# Altium schematic sheet 04_PSoC6.SchDoc: PSoC6
size A; Revision: A; SheetNumber: 4; SheetTotal: 8; ECE315_Project_Name: ECE453 MCU Base Project
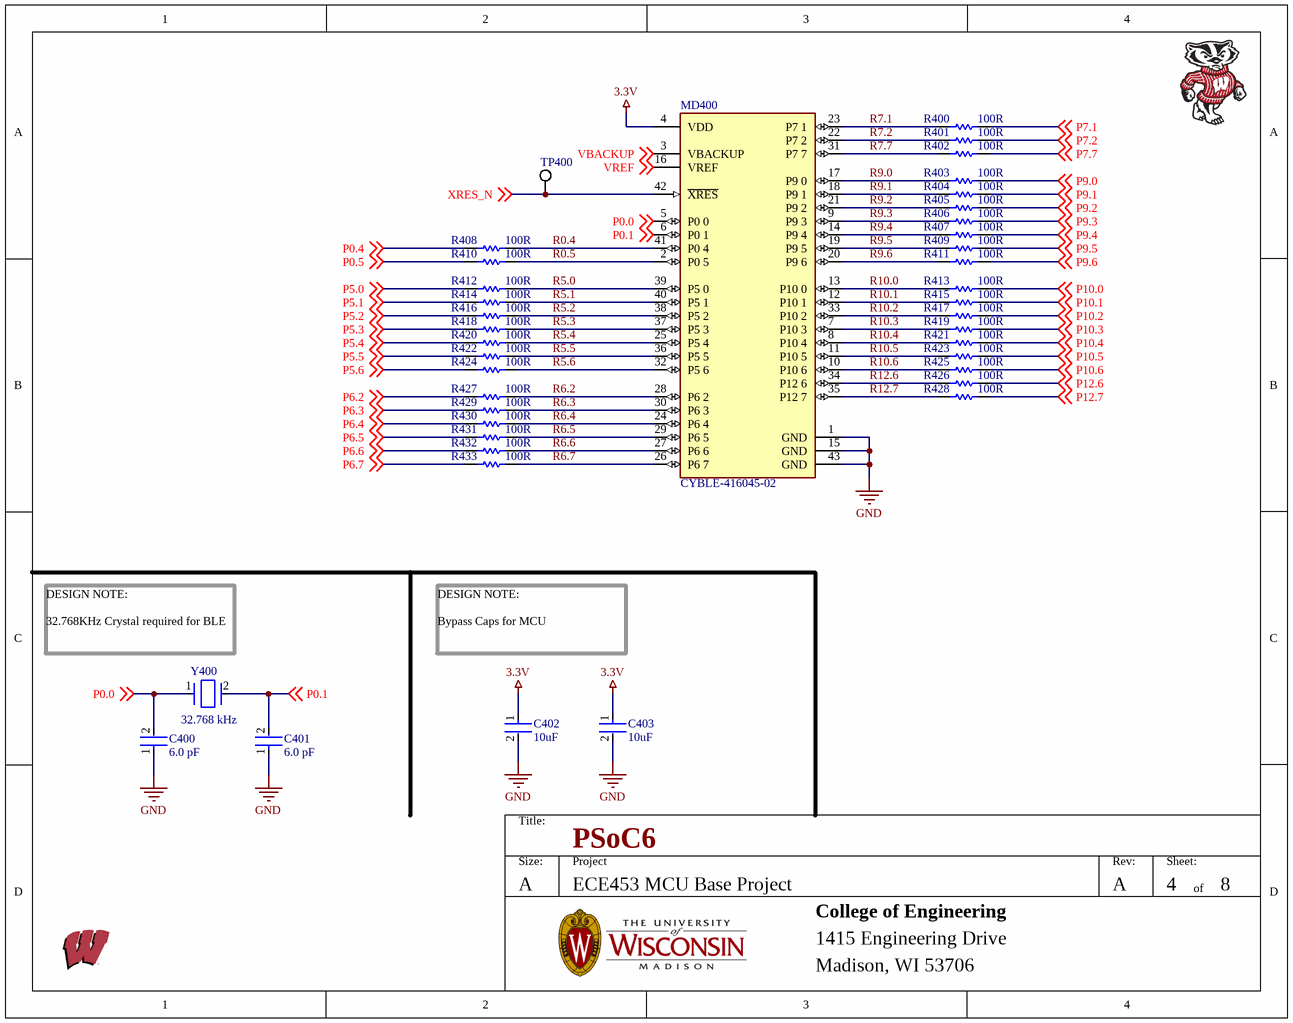
[diagram p0: 04_PSoC6.SchDoc]

## Parts
C400  6.0 pF  [FP-CBR08C-MFG]
C401  6.0 pF  [FP-CBR08C-MFG]
C402  10uF  [FP-C0805C-DG-MFG]
C403  10uF  [FP-C0805C-DG-MFG]
MD400  CYBLE-416045-02  [FP-CYBLE-416045-02-MFG]
R400  100R  [RESC2013X60X40ML20T25]
R401  100R  [RESC2013X60X40ML20T25]
R402  100R  [RESC2013X60X40ML20T25]
R403  100R  [RESC2013X60X40ML20T25]
R404  100R  [RESC2013X60X40ML20T25]
R405  100R  [RESC2013X60X40ML20T25]
R406  100R  [RESC2013X60X40ML20T25]
R407  100R  [RESC2013X60X40ML20T25]
R408  100R  [RESC2013X60X40ML20T25]
R409  100R  [RESC2013X60X40ML20T25]
R410  100R  [RESC2013X60X40ML20T25]
R411  100R  [RESC2013X60X40ML20T25]
R412  100R  [RESC2013X60X40ML20T25]
R413  100R  [RESC2013X60X40ML20T25]
R414  100R  [RESC2013X60X40ML20T25]
R415  100R  [RESC2013X60X40ML20T25]
R416  100R  [RESC2013X60X40ML20T25]
R417  100R  [RESC2013X60X40ML20T25]
R418  100R  [RESC2013X60X40ML20T25]
R419  100R  [RESC2013X60X40ML20T25]
R420  100R  [RESC2013X60X40ML20T25]
R421  100R  [RESC2013X60X40ML20T25]
R422  100R  [RESC2013X60X40ML20T25]
R423  100R  [RESC2013X60X40ML20T25]
R424  100R  [RESC2013X60X40ML20T25]
R425  100R  [RESC2013X60X40ML20T25]
R426  100R  [RESC2013X60X40ML20T25]
R427  100R  [RESC2013X60X40ML20T25]
R428  100R  [RESC2013X60X40ML20T25]
R429  100R  [RESC2013X60X40ML20T25]
R430  100R  [RESC2013X60X40ML20T25]
R431  100R  [RESC2013X60X40ML20T25]
R432  100R  [RESC2013X60X40ML20T25]
R433  100R  [RESC2013X60X40ML20T25]
TP400  (no value)  [KSTN-5019_V]
Y400  32.768 kHz  [FP-ABS07-120-MFG]

## Nets
3.3V: C402.1 C403.1 MD400.4(VDD)
GND: C400.1 C401.1 C402.2 C403.2 MD400.1(GND) MD400.15(GND) MD400.43(GND)
P0.0: C400.2 MD400.5(P0_0) Y400.1 ; off-sheet P0.0
P0.1: C401.2 MD400.6(P0_1) Y400.2 ; off-sheet P0.1
P0.4: R408.1 ; off-sheet P0.4
P0.5: R410.1 ; off-sheet P0.5
P5.0: R412.1 ; off-sheet P5.0
P5.1: R414.1 ; off-sheet P5.1
P5.2: R416.1 ; off-sheet P5.2
P5.3: R418.1 ; off-sheet P5.3
P5.4: R420.1 ; off-sheet P5.4
P5.5: R422.1 ; off-sheet P5.5
P5.6: R424.1 ; off-sheet P5.6
P6.2: R427.1 ; off-sheet P6.2
P6.3: R429.1 ; off-sheet P6.3
P6.4: R430.1 ; off-sheet P6.4
P6.5: R431.1 ; off-sheet P6.5
P6.6: R432.1 ; off-sheet P6.6
P6.7: R433.1 ; off-sheet P6.7
P7.1: R400.2 ; off-sheet P7.1
P7.2: R401.2 ; off-sheet P7.2
P7.7: R402.2 ; off-sheet P7.7
P9.0: R403.2 ; off-sheet P9.0
P9.1: R404.2 ; off-sheet P9.1
P9.2: R405.2 ; off-sheet P9.2
P9.3: R406.2 ; off-sheet P9.3
P9.4: R407.2 ; off-sheet P9.4
P9.5: R409.2 ; off-sheet P9.5
P9.6: R411.2 ; off-sheet P9.6
P10.0: R413.2 ; off-sheet P10.0
P10.1: R415.2 ; off-sheet P10.1
P10.2: R417.2 ; off-sheet P10.2
P10.3: R419.2 ; off-sheet P10.3
P10.4: R421.2 ; off-sheet P10.4
P10.5: R423.2 ; off-sheet P10.5
P10.6: R425.2 ; off-sheet P10.6
P12.6: R426.2 ; off-sheet P12.6
P12.7: R428.2 ; off-sheet P12.7
R0.4: MD400.41(P0_4) R408.2
R0.5: MD400.2(P0_5) R410.2
R5.0: MD400.39(P5_0) R412.2
R5.1: MD400.40(P5_1) R414.2
R5.2: MD400.38(P5_2) R416.2
R5.3: MD400.37(P5_3) R418.2
R5.4: MD400.25(P5_4) R420.2
R5.5: MD400.36(P5_5) R422.2
R5.6: MD400.32(P5_6) R424.2
R6.2: MD400.28(P6_2) R427.2
R6.3: MD400.30(P6_3) R429.2
R6.4: MD400.24(P6_4) R430.2
R6.5: MD400.29(P6_5) R431.2
R6.6: MD400.27(P6_6) R432.2
R6.7: MD400.26(P6_7) R433.2
R7.1: MD400.23(P7_1) R400.1
R7.2: MD400.22(P7_2) R401.1
R7.7: MD400.31(P7_7) R402.1
R9.0: MD400.17(P9_0) R403.1
R9.1: MD400.18(P9_1) R404.1
R9.2: MD400.21(P9_2) R405.1
R9.3: MD400.9(P9_3) R406.1
R9.4: MD400.14(P9_4) R407.1
R9.5: MD400.19(P9_5) R409.1
R9.6: MD400.20(P9_6) R411.1
R10.0: MD400.13(P10_0) R413.1
R10.1: MD400.12(P10_1) R415.1
R10.2: MD400.33(P10_2) R417.1
R10.3: MD400.7(P10_3) R419.1
R10.4: MD400.8(P10_4) R421.1
R10.5: MD400.11(P10_5) R423.1
R10.6: MD400.10(P10_6) R425.1
R12.6: MD400.34(P12_6) R426.1
R12.7: MD400.35(P12_7) R428.1
VBACKUP: MD400.3(VBACKUP) ; off-sheet VBACKUP
VREF: MD400.16(VREF) ; off-sheet VREF
XRES_N: MD400.42(~{XRES}) TP400.1 ; off-sheet XRES_N

## Notes on the sheet
- (near Y400) DESIGN NOTE:
  32.768KHz Crystal required for BLE
- DESIGN NOTE:
  Bypass Caps for MCU
- Title:
- Size:
- A
- Project
- Rev:
- Sheet:
- of
- College of Engineering
- 1415 Engineering Drive
- Madison, WI 53706

## Library data of the parts
C400 C401 = CMP-03020-018446-1: CAP CER 6PF 250V C0G/NP0 0805; Manufacturer Part Number: CBR08C609CAGAC; Manufacturer: KEMET; Temperature Characteristic: C0G; Tolerance: 0.25 pF; Material: Ceramic; Temperature Coefficient: 30ppm/°C; Lead Free: Yes; Category: Cap; Device Class L3: Ceramic Capacitors; Temperature: -55°C to +125°C; Height: 0.95mm; Package: CBR08C; Temperature Range Low: -55°C; Device Class L1: Passive Components; ComponentLink2Description: Datasheet; ComponentLink2URL: https://content.kemet.com/datasheets/KEM_C1030_CBR_SMD.pdf; Digikey Description: CAP CER 6PF 250V C0G/NP0 0805; Ipc Land Pattern Name: CAPC200125X85; Octopart: https://octopart.com/cbr08c609cagac-kemet-23841672; Device Class L2: Capacitors; Temperature Range High: +125°C; Voltage Rating: 250 V; RoHS: TRUE; Capacitance: 6.0 pF; Mouser Description: Multilayer Ceramic Capacitors MLCC - SMD/SMT 250volts 6pF C0G 0805 .25pF Tol RF; Value: 6.0 pF; Automotive: No
C402 C403 = CMP-2007-03243-2: CAP CER 10UF 10V X5R 0805; Manufacturer Part Number: C0805C106K8PACTU; Manufacturer: Kemet; 3DS Part Number: 220-00001; Tolerance: 10%; Temperature Coefficient: 15%; Material: Ceramic; Device Class L2: Capacitors; Device Class L1: Passive Components; ComponentLink2URL: https://content.kemet.com/datasheets/KEM_C1006_X5R_SMD.pdf; Height: 1.4mm; Lead Free: Yes; Digikey Description: CAP CER 10UF 10V X5R 0805; Octopart: https://octopart.com/c0805c106k8pactu-kemet-98697; Capacitance: 10uF; Value: 10uF; Temperature Range Low: -55°C; Temperature: -55°C to +85°C; Automotive: No; Mouser Description: CAP CER 10UF 10V X5R 0805; Ipc Land Pattern Name: CAPC200125X125; Temperature Range High: +85°C; Voltage: 10V; RoHS: TRUE; Device Class L3: Ceramic Capacitors; ComponentLink2Description: Datasheet; Voltage Rating: 10V; Package: C0805C-DG; Temperature Characteristic: X5R; Category: Cap
MD400 = CMP-12964-000002-1: RF TXRX MOD BLUETOOTH TRACE ANT; Manufacturer: Cypress Semiconductor; Number Of Gpio: 36; Number Of Adc Channels: 1; Max Supply Voltage: 3.6V; Min Supply Voltage: 1.71V; Data Rate: 2Mbits/s; Receiving Current: 6.7mA; Max Frequency: 2.5GHz; Bandwidth: 100MHz; Transmitting Current: 5.7mA; Interface: I2C,SPI,UART,I2S,Other; Octopart: https://octopart.com/cyble-416045-02-cypress+semiconductor-96386825; Lead Free: Yes; RoHS: TRUE; Device Class L3: Transceivers; Category: UNK; Package: 0; Device Class L2: RF Semiconductors and Devices; Automotive: No; ComponentLink2URL: https://www.cypress.com/file/428336/download; Temperature Range Low: -40°C; Height: 2mm; Device Class L1: Integrated Circuits (ICs); Manufacturer Part Number: CYBLE-416045-02; ComponentLink2Description: Datasheet; Digikey Description: RF TXRX MOD BLUETOOTH TRACE ANT; Temperature: -40°C to +85°C; Temperature Range High: +85°C
R400-R433 = CMP-2001-00580-1: Manufacturer: Panasonic; Part Number: ERA6AEB101V
TP400 = CMP-1672-00008-1: Test Point, 1 Position SMD, RoHS, Tape and Reel; ComponentLink1Description: Manufacturer URL; Package Quantity: 1000; DatasheetVersion: 03/2014; Packaging: Tape and Reel; ComponentLink2URL: http://www.keyelco.com/product-pdf.cfm?p=1357; ComponentLink1URL: http://www.keyelco.com/; Mount: Surface Mount; Contact Plating: Silver; PackageDescription: 1-Pin Surface Mount Device, Body 3.81 x 2.03 mm; Pins: 1; RoHSCompliant: True; Mounting Technology: Surface Mount; ComponentLink2Description: Datasheet; PackageReference: 5019
Y400 = CMP-2000-07587-2: CRYSTAL 32.7680KHZ 6PF SMD; Frequency Tolerance: 20ppm; Series Resistance: 60kR; ESR (Equivalent Series Resistance): 55kR; Depth: 1.5mm; Width: 0.061inch; Number of Pins: 2; Max Operating Temperature: 85°C; Length: 3.2mm; Case/Package: SMD/SMT; Series: ABS07; Lead Free: Lead Free; Min Operating Temperature: -40°C; Load Capacitance: 6pF; Packaging: Tape and Reel; Height: 0.035inch; Radiation Hardening: No; Tolerance: 20ppm; Operating Frequency: 32.768 kHz; Termination: SMD/SMT; REACH SVHC: No SVHC; RoHS Compliant: Yes; Frequency: 32.768kHz; Package Quantity: 3000; Mount: Surface Mount